# EasyEDA schematic SCH_HackerCard_2024-08-18.json
TITLE: Sheet_1; REV: 1.0; Date: 2024-08-17; Sheet: 1/1; Drawn By: linuxdino; Company: Your Company
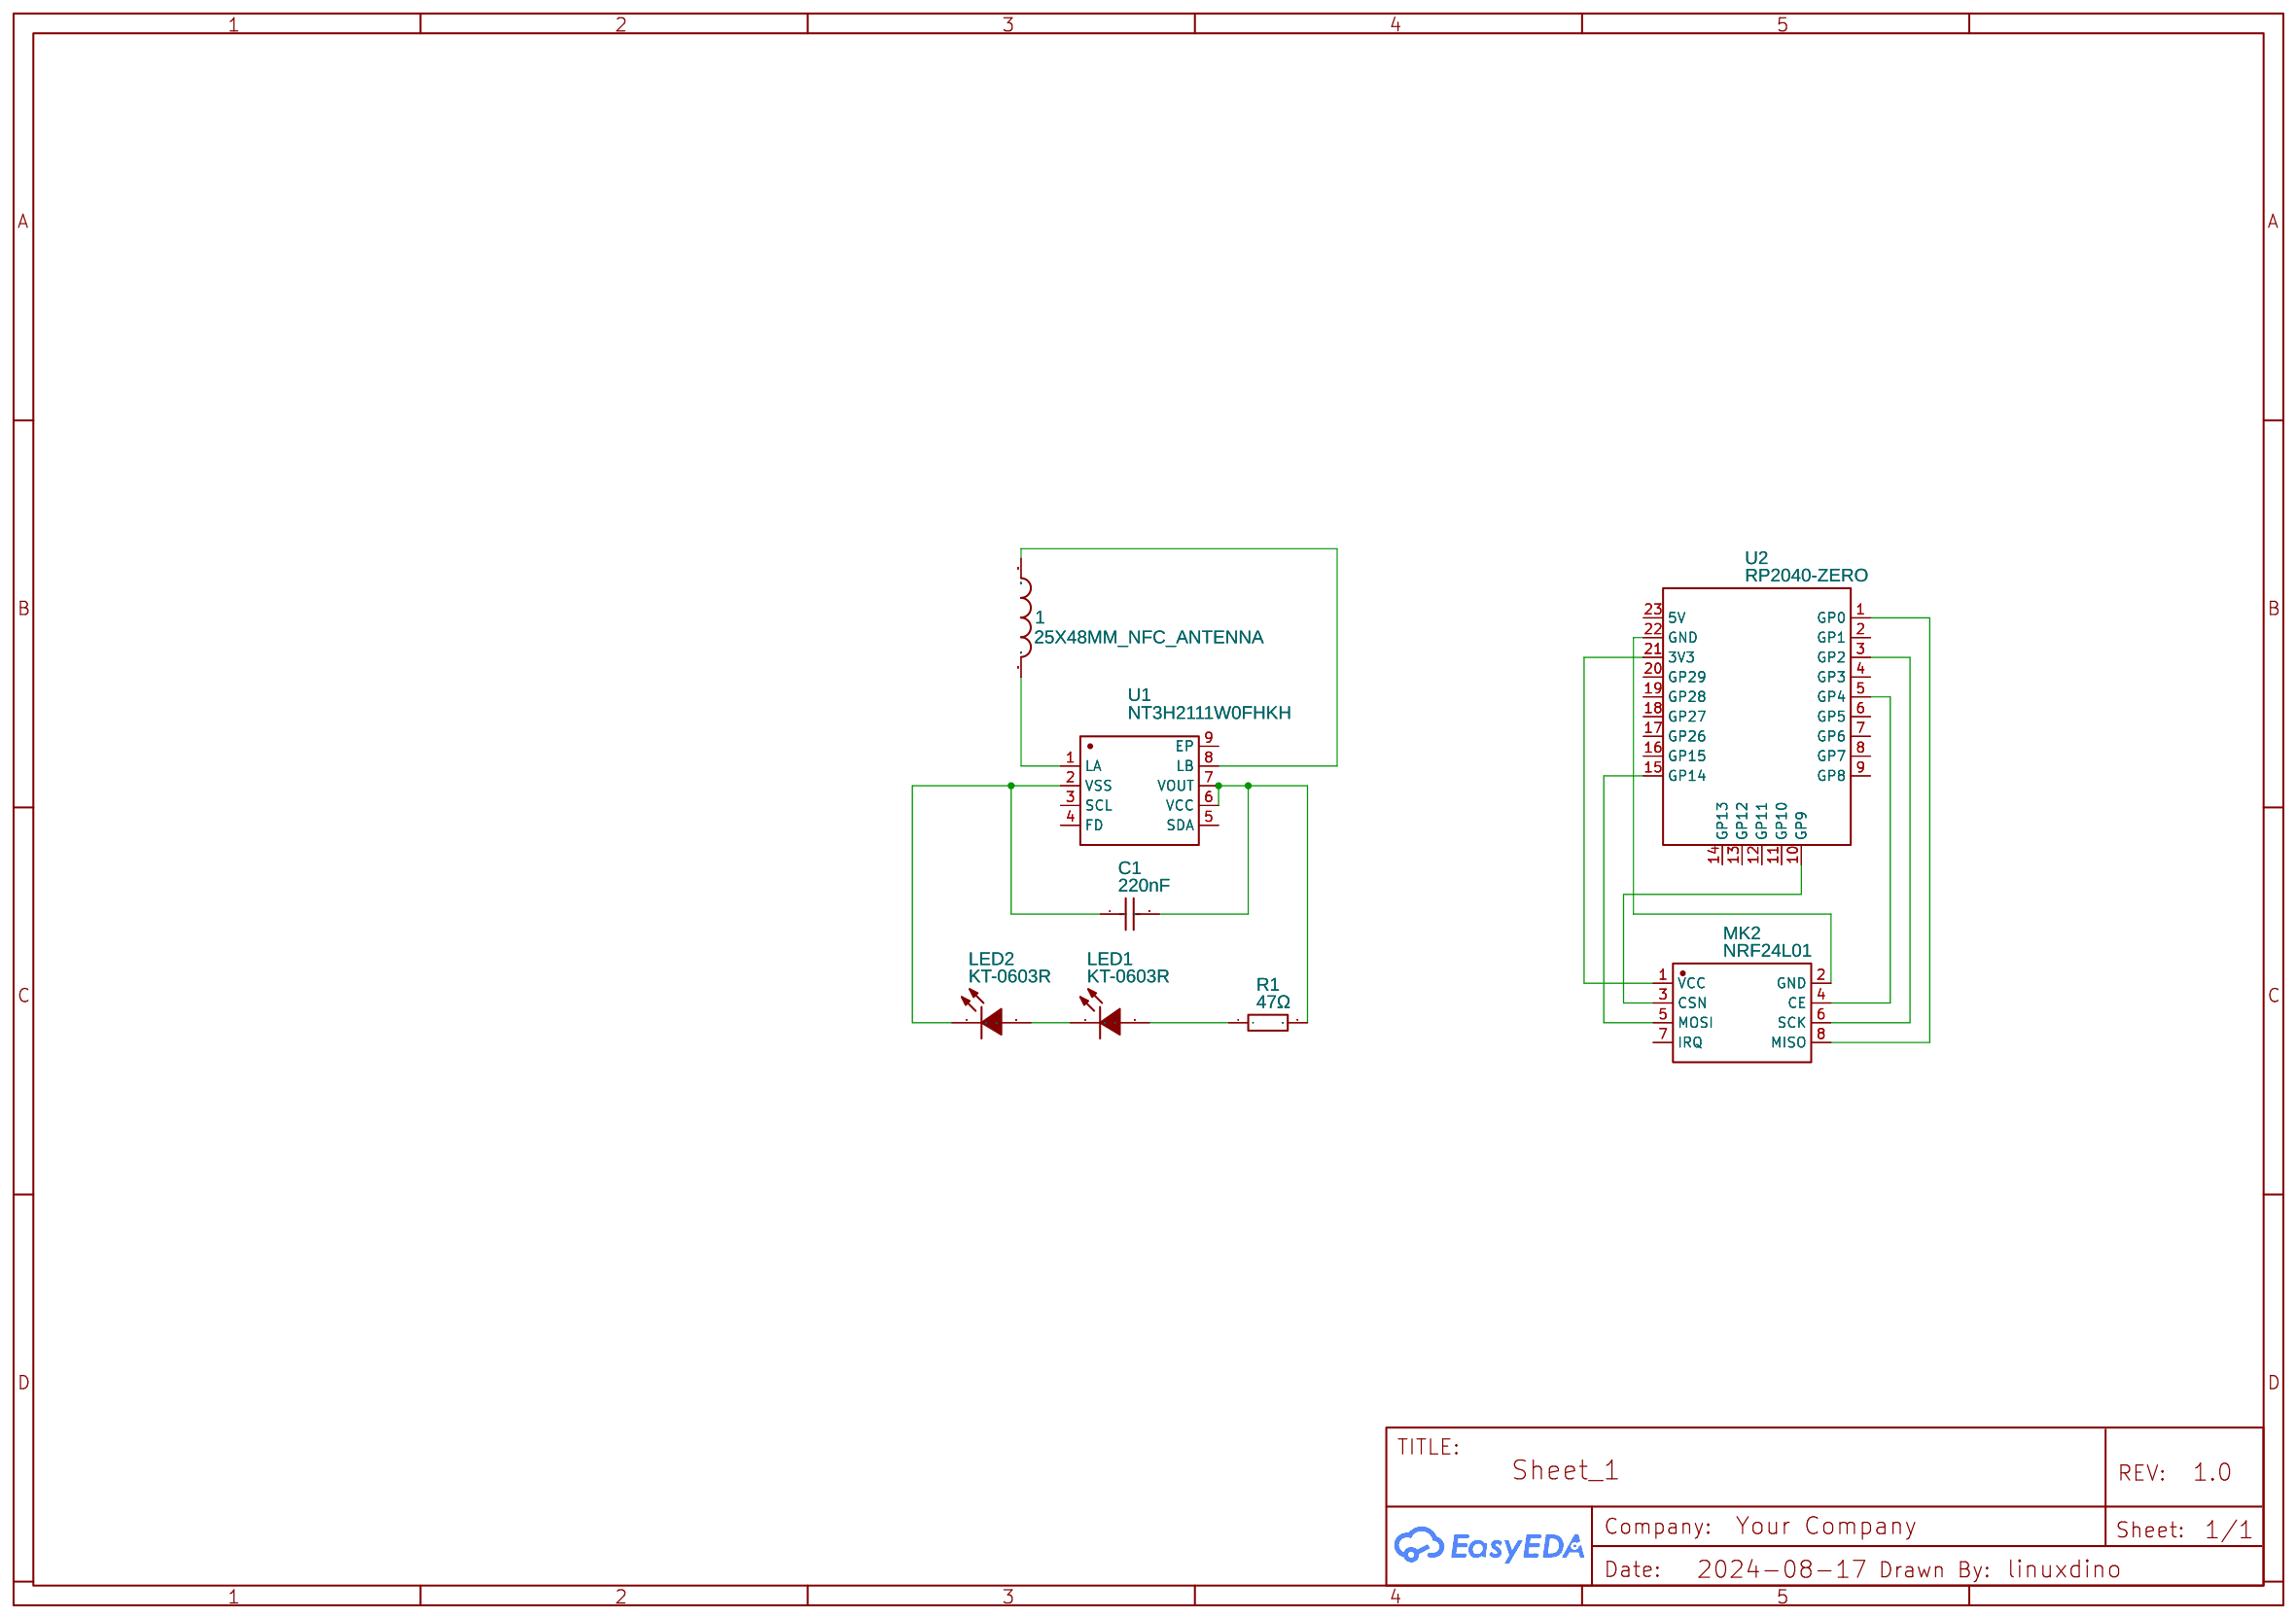
[diagram p0: schematic sheet]

## Parts
1  25X48MM_NFC_ANTENNA  [25X48MM_NFC_ANTENNA]
C1  220nF  [C0603]
LED1  KT-0603R  [LED0603-RD]
LED2  KT-0603R  [LED0603-RD]
MK2  NRF24L01  [WIRELM-SMD_NRF24L01]
R1  47Ω  [R0603]
U1  NT3H2111W0FHKH  [XQFN-8_L1.6-W1.6-P0.50-BL]
U2  RP2040-ZERO  [COMM-SMD_RP2040-ZERO]

## Library data of the parts
1 = 25X48MM_NFC_ANTENNA: Contributor: LoneWalkerWolf
C1 = CL10B224KA8NNNC: Supplier: LCSC; Manufacturer: SAMSUNG(三星); Supplier Part: C21120; JLCPCB Part Class: Basic Part
LED1 LED2 = KT-0603R: Supplier: LCSC; Manufacturer: KENTO; Supplier Part: C2286; JLCPCB Part Class: Basic Part
MK2 = NRF24L01: Supplier: LCSC; Manufacturer: Ai-Thinker(安信可); Manufacturer Part: NF-04; Supplier Part: C90751; JLCPCB Part Class: Extended Part
R1 = 0603WAF470JT5E: Supplier: LCSC; Manufacturer: UNI-ROYAL(厚声); Supplier Part: C23182; JLCPCB Part Class: Basic Part
U1 = NT3H2111W0FHKH: Contributor: LCSC; Supplier: LCSC; Supplier Part: C710403; Manufacturer: NXP(恩智浦); JLCPCB Part Class: Extended Part
U2 = RP2040-ZERO: Supplier: LCSC; Supplier Part: C5350143; Manufacturer: Waveshare(微雪电子); Manufacturer Part: RP2040-Zero; JLCPCB Part Class: Extended Part; Contributor: lcsc

## Nets
Net-(1-P$1): 1.P$1 U1.8(LB)
Net-(1-P$2): 1.P$2 U1.1(LA)
Net-(C1-1): C1.1 LED2.1(K) U1.2(VSS)
Net-(C1-2): C1.2 R1.2 U1.6(VCC) U1.7(VOUT)
Net-(LED1-1): LED1.1(K) LED2.2(A)
Net-(LED1-2): LED1.2(A) R1.1
Net-(MK2-1): MK2.1(VCC) U2.21(3V3)
Net-(MK2-2): MK2.2(GND) U2.22(GND)
Net-(MK2-3): MK2.3(CSN) U2.10(GP9)
Net-(MK2-4): MK2.4(CE) U2.5(GP4)
Net-(MK2-5): MK2.5(MOSI) U2.15(GP14)
Net-(MK2-6): MK2.6(SCK) U2.3(GP2)
Net-(MK2-8): MK2.8(MISO) U2.1(GP0)

Not connected (* = marked no-connect by the designer): MK2 7(IRQ); U1 3(SCL) 4(FD) 5(SDA) 9(EP); U2 2(GP1) 4(GP3) 6(GP5) 7(GP6) 8(GP7) 9(GP8) 11(GP10) 12(GP11) 13(GP12) 14(GP13) 16(GP15) 17(GP26) 18(GP27) 19(GP28) 20(GP29) 23(5V)
